# Altium schematic sheet Sheet1.SchDoc
size A4; DrawnBy: Schuszter André
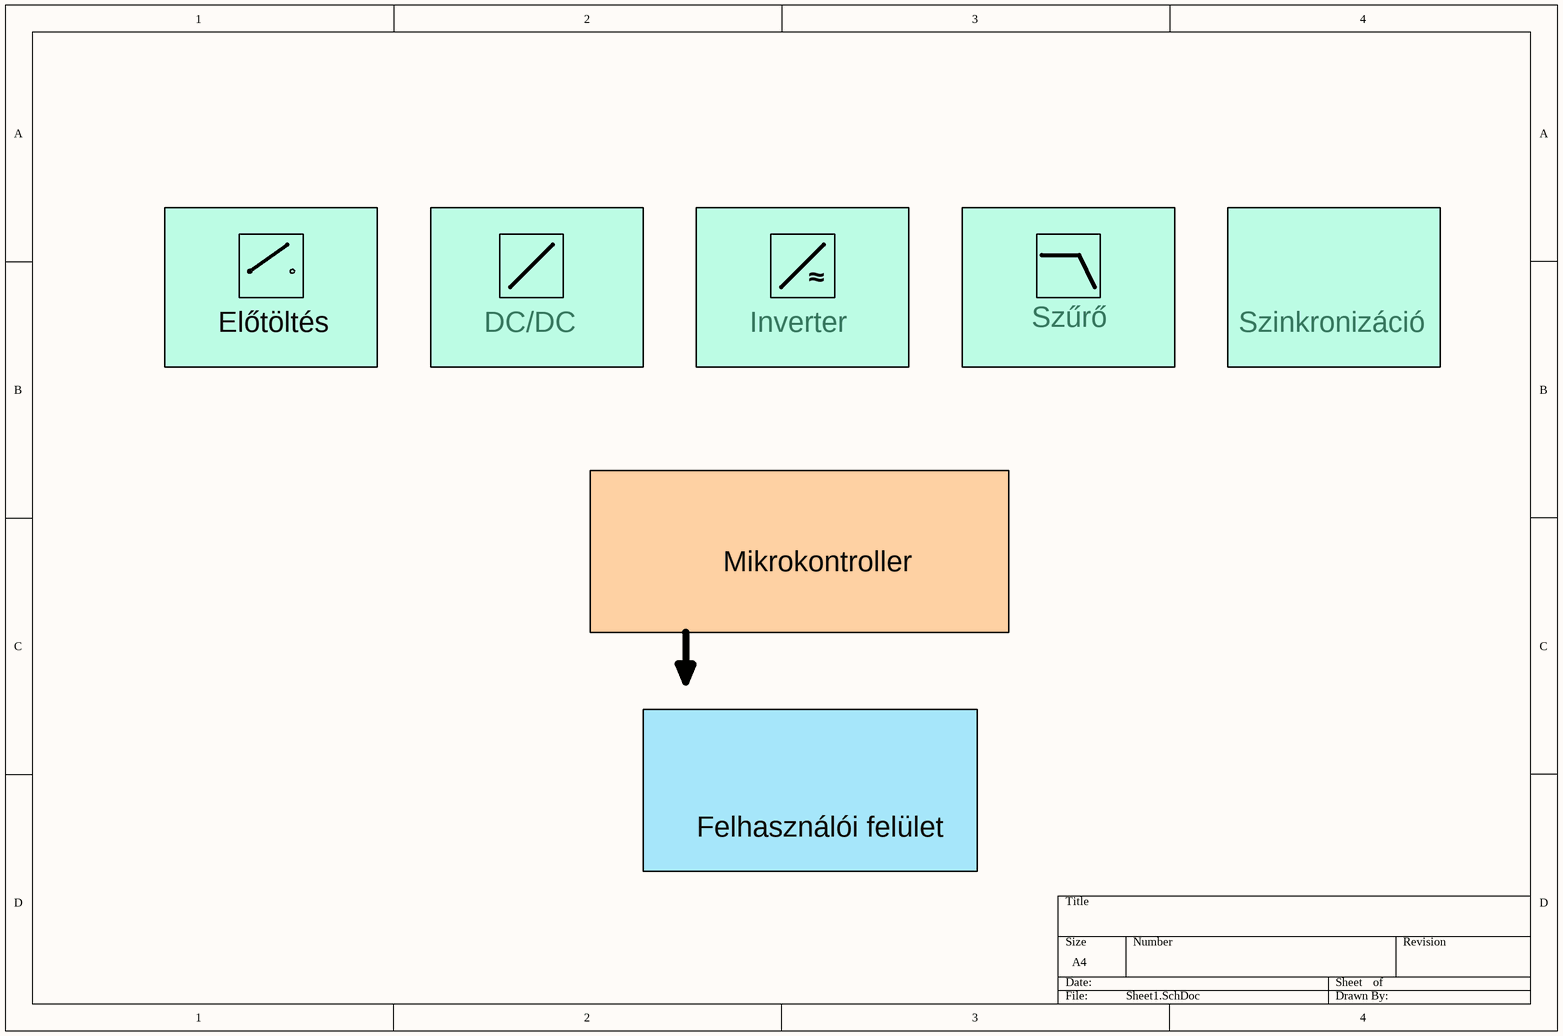
[diagram p0: Sheet1.SchDoc]

## Notes on the sheet
- ~
- Előtöltés
- DC/DC
- Inverter
- Szűrő
- Szinkronizáció
- Mikrokontroller
- Felhasználói felület